# EAGLE design Mega8515_flasher_v2 (EAGLE 8.1.0)
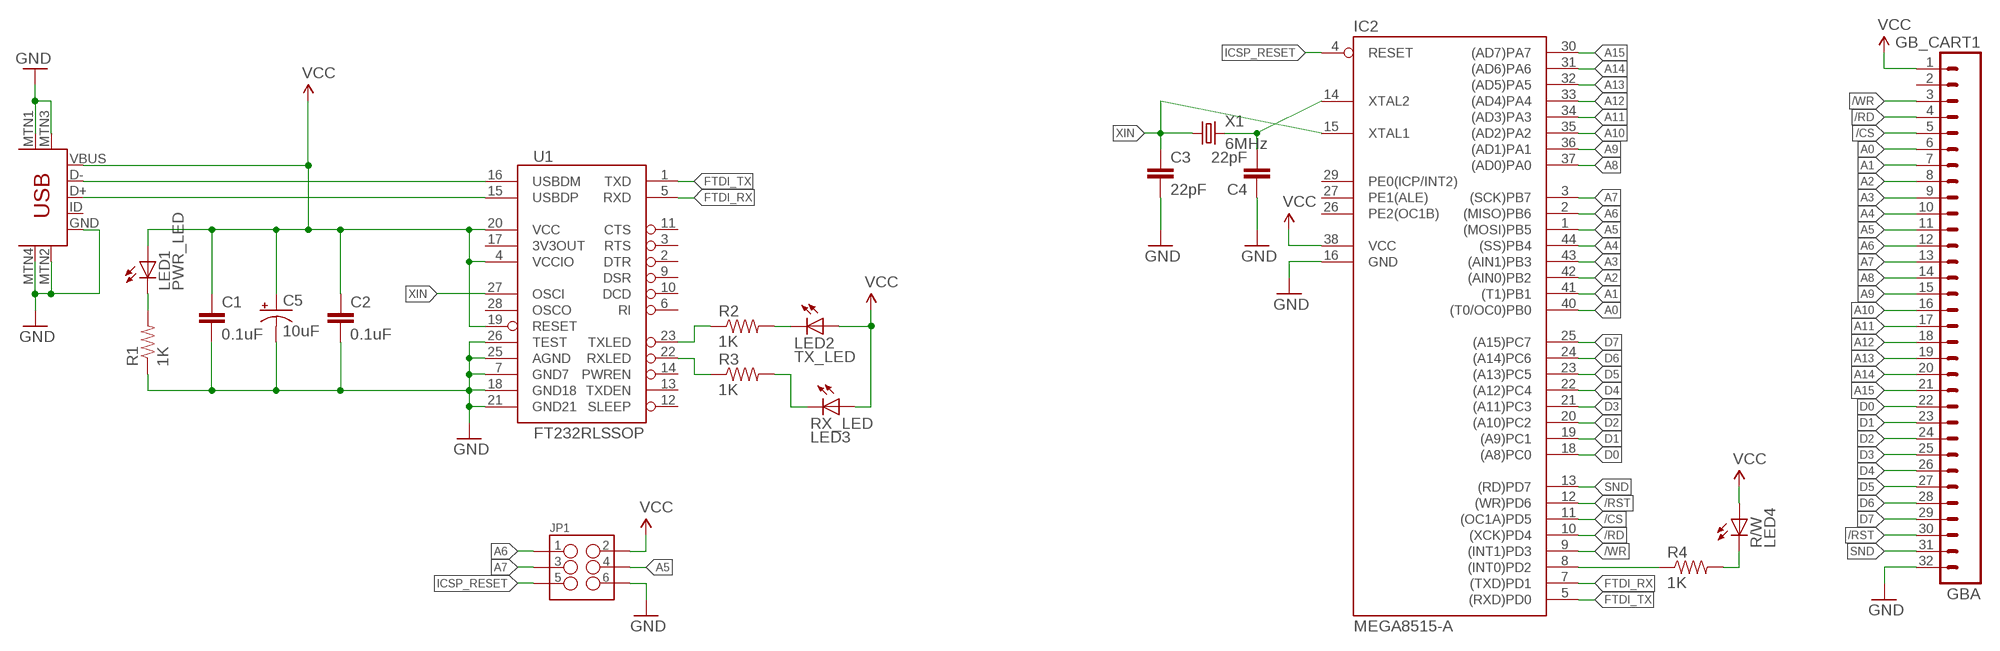
[diagram p0: schematic, sheet 1]

## Parts
C1  0.1uF  CAP1206  [1206]
C2  0.1uF  CAP1206  [1206]
C3  22pF  CAP0805  [0805]
C4  22pF  CAP0805  [0805]
C5  10uF  10UF-TANT  [EIA3216]
GBA  GB_CART1  [GB_CART_1]
IC2  MEGA8515-A  [TQFP44]
JP1  SPARKFUN-CONNECTORS_M03X2SMT  [SPARKFUN-CONNECTORS_2X3_SMT_POSTS]
LED1  PWR_LED  LED1206  [LED-1206]
LED2  TX_LED  LED1206  [LED-1206]
R1  1K  RESISTOR1206  [1206]
R2  1K  RESISTOR1206  [1206]
R3  1K  RESISTOR1206  [1206]
R4  1K  RESISTOR1206  [1206]
R/W  LED4  LED1206  [LED-1206]
RX_LED  LED3  LED1206  [LED-1206]
U1  FT232RLSSOP  [SSOP28DB]
USB  USB-MINIB-5PIN  [USB-MINIB]
X1  6MHz  SPARKFUN-FREQCTRL_CRYSTAL  [SPARKFUN-FREQCTRL_CRYSTAL-SMD-11.8X5.5]

## Nets
/CS: GBA.5 IC2.11((OC1A)PD5)
/RD: GBA.4 IC2.10((XCK)PD4)
/RST: GBA.30 IC2.12((WR)PD6)
/WR: GBA.3 IC2.9((INT1)PD3)
A0: GBA.6 IC2.40((T0/OC0)PB0)
A1: GBA.7 IC2.41((T1)PB1)
A2: GBA.8 IC2.42((AIN0)PB2)
A3: GBA.9 IC2.43((AIN1)PB3)
A4: GBA.10 IC2.44((SS)PB4)
A5: GBA.11 IC2.1((MOSI)PB5) JP1.4
A6: GBA.12 IC2.2((MISO)PB6) JP1.1
A7: GBA.13 IC2.3((SCK)PB7) JP1.3
A8: GBA.14 IC2.37((AD0)PA0)
A9: GBA.15 IC2.36((AD1)PA1)
A10: GBA.16 IC2.35((AD2)PA2)
A11: GBA.17 IC2.34((AD3)PA3)
A12: GBA.18 IC2.33((AD4)PA4)
A13: GBA.19 IC2.32((AD5)PA5)
A14: GBA.20 IC2.31((AD6)PA6)
A15: GBA.21 IC2.30((AD7)PA7)
D0: GBA.22 IC2.18((A8)PC0)
D1: GBA.23 IC2.19((A9)PC1)
D2: GBA.24 IC2.20((A10)PC2)
D3: GBA.25 IC2.21((A11)PC3)
D4: GBA.26 IC2.22((A12)PC4)
D5: GBA.27 IC2.23((A13)PC5)
D6: GBA.28 IC2.24((A14)PC6)
D7: GBA.29 IC2.25((A15)PC7)
FTDI_RX: IC2.7((TXD)PD1) U1.5(RXD)
FTDI_TX: IC2.5((RXD)PD0) U1.1(TXD)
GND: C1.2 C2.2 C3.2 C4.1 C5.C(-) GBA.32 IC2.16(GND) JP1.6 R1.1 U1.7(GND7) U1.18(GND18) U1.21(GND21) U1.25(AGND) U1.26(TEST) USB.GND USB.MTN1(MTN2) USB.MTN2(MTN3) USB.MTN3(MTN1) USB.MTN4
ICSP_RESET: IC2.4(RESET) JP1.5
N$1: C4.2 IC2.14(XTAL2) X1.2 X1.3
N$5: R4.2 R/W.C
N$8: R3.2 RX_LED.C
N$9: LED2.C R2.2
N$13: U1.16(USBDM) USB.D-
N$14: U1.15(USBDP) USB.D+
N$16: LED1.C R1.2
RWLED: IC2.8((INT0)PD2) R4.1
RXLED: R3.1 U1.22(RXLED)
SND: GBA.31 IC2.13((RD)PD7)
TXLED: R2.1 U1.23(TXLED)
VCC: C1.1 C2.1 C5.A(+) GBA.1 IC2.38(VCC) JP1.2 LED1.A LED2.A R/W.A RX_LED.A U1.4(VCCIO) U1.19(RESET) U1.20(VCC) USB.VBUS
XIN: C3.1 IC2.15(XTAL1) U1.27(OSCI) X1.1 X1.4
Unconnected: GBA.2 IC2.6(NC1) IC2.17(NC2) IC2.26(PE2(OC1B)) IC2.27(PE1(ALE)) IC2.28(NC3) IC2.29(PE0(ICP/INT2)) IC2.39(NC4) U1.2(DTR) U1.3(RTS) U1.6(RI) U1.9(DSR) U1.10(DCD) U1.11(CTS) U1.12(SLEEP) U1.13(TXDEN) U1.14(PWREN) U1.17(3V3OUT) U1.28(OSCO) USB.ID

## Library data of the parts
C1-C4 = SparkFun-Capacitors:CAP: Capacitor Standard 0603 ceramic capacitor, and 0.1" leaded capacitor.
C5 = SparkFun-Capacitors:10UF-TANT: 10uF Tantalum SMT CAP-00811- 16V 10% (EIA-3216); PROD_ID: CAP-00811
GBA = alex:GB_CART
IC2 = atmel:MEGA8515: MICROCONTROLLER 8 Kbytes FLASH 512 bytes SRAM 512 bytes EEPROM USART 8-channel 10 bit ADC Source: avr.lbr; MPN: ATMEGA8515-16AU; OC_FARNELL: 9171410; OC_NEWARK: 01M6904
JP1 = Mega8515_flasher:SPARKFUN-CONNECTORS_M03X2: 2x3 .1" header. Shrouded, with keying- CONN-10681 SMT- CONN-11415 Pogo pins- HW-11044; PROD_ID: CONN-11415
LED1 LED2 R/W RX_LED = SparkFun-LED:LED: LEDs Standard schematic elements and footprints for 5mm, 3mm, 1206, and 0603 sized LEDs. 5mm - Spark Fun Electronics SKU : COM-00529 (and others)
R1-R4 = SparkFun-Resistors:RESISTOR: Resistor Basic schematic elements and footprints for 0603, 1206, and PTH resistors.
U1 = SparkFun-DigitalIC:FT232RL: USB UART FT232RL 4th Generation USB UART (USB <-> Serial) Controller. Spark Fun Electronics SKU : COM-00650 Production SKU IC-00870; PROD_ID: IC-00870
USB = SparkFun-Connectors:USB-MINIB: Mini-USB "B" connector with 5th pin broken out. Created new symbol breaking out 5th "ID" pin in mini/micro USB connector spec. See: http://en.wikipedia.org/wiki/Mini_usb#Cables. Uses same footprint as 4-pin symbol. Also added pins to connect to mounting / shield pads if required (probably not generally needed as signals aren't shielded once they leave the connector).
X1 = Mega8515_flasher:SPARKFUN-FREQCTRL_CRYSTAL: Various standard crystals. Proven footprints. Spark Fun Electronics SKU : COM-00534

## Net classes
0 default: width 0.152 mm, drill 0.305 mm, clearance 0.152 mm

## Board
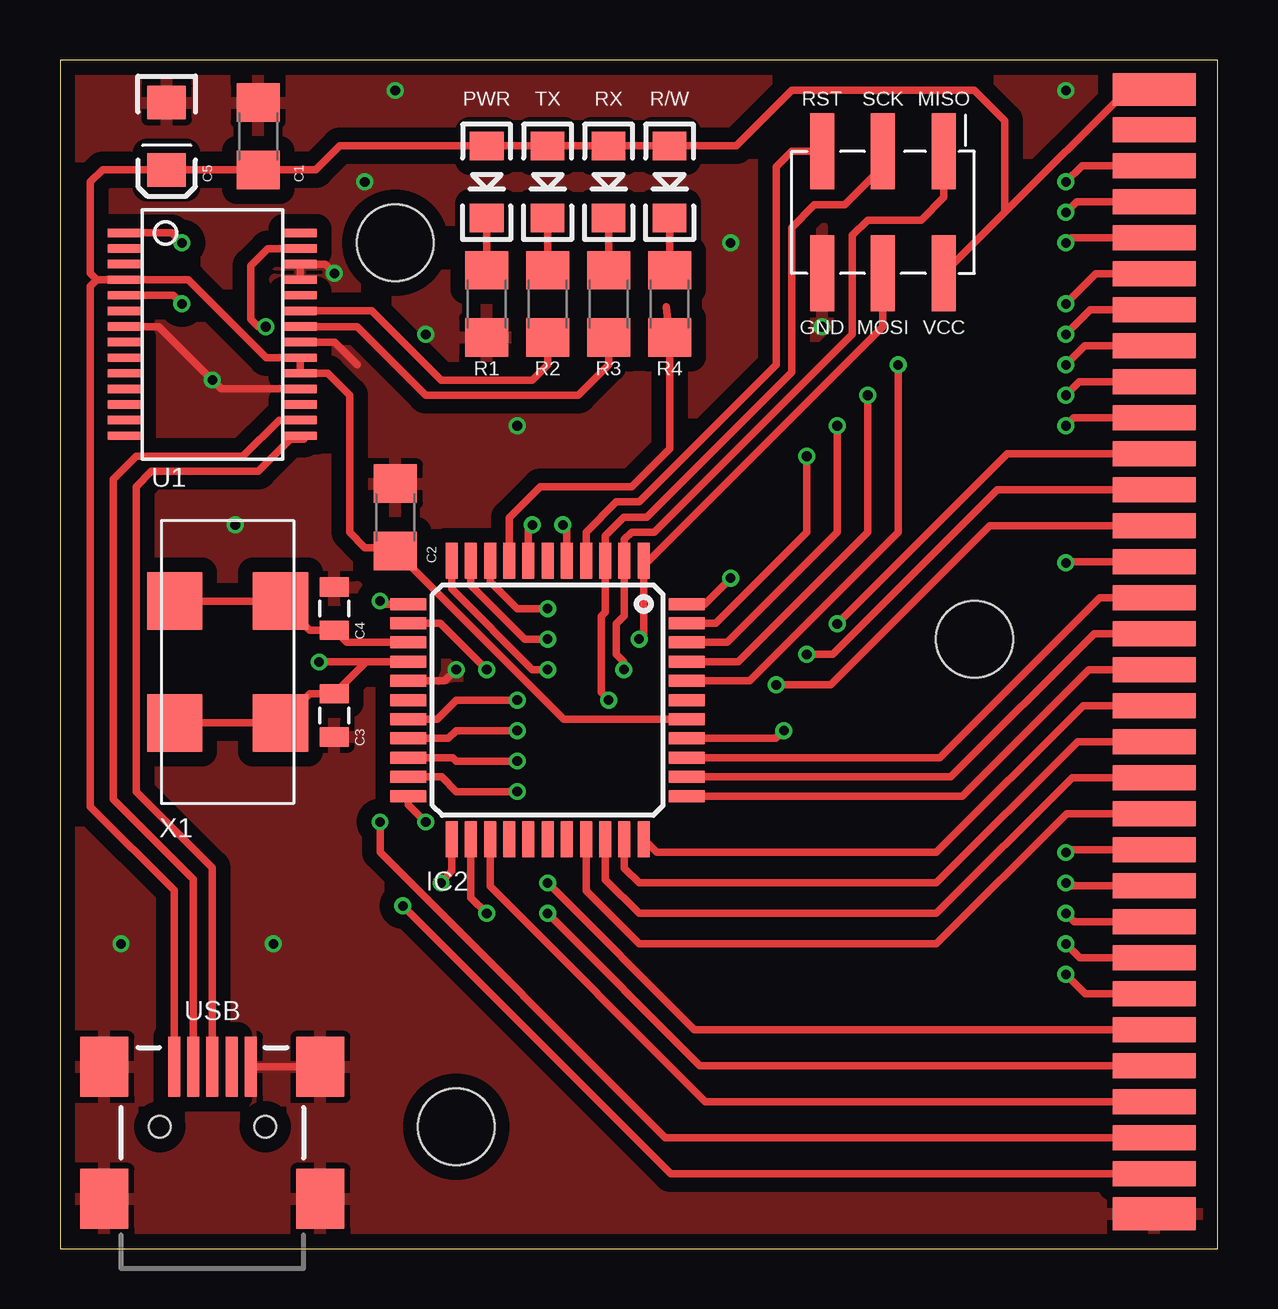
[diagram p1: board, top side]
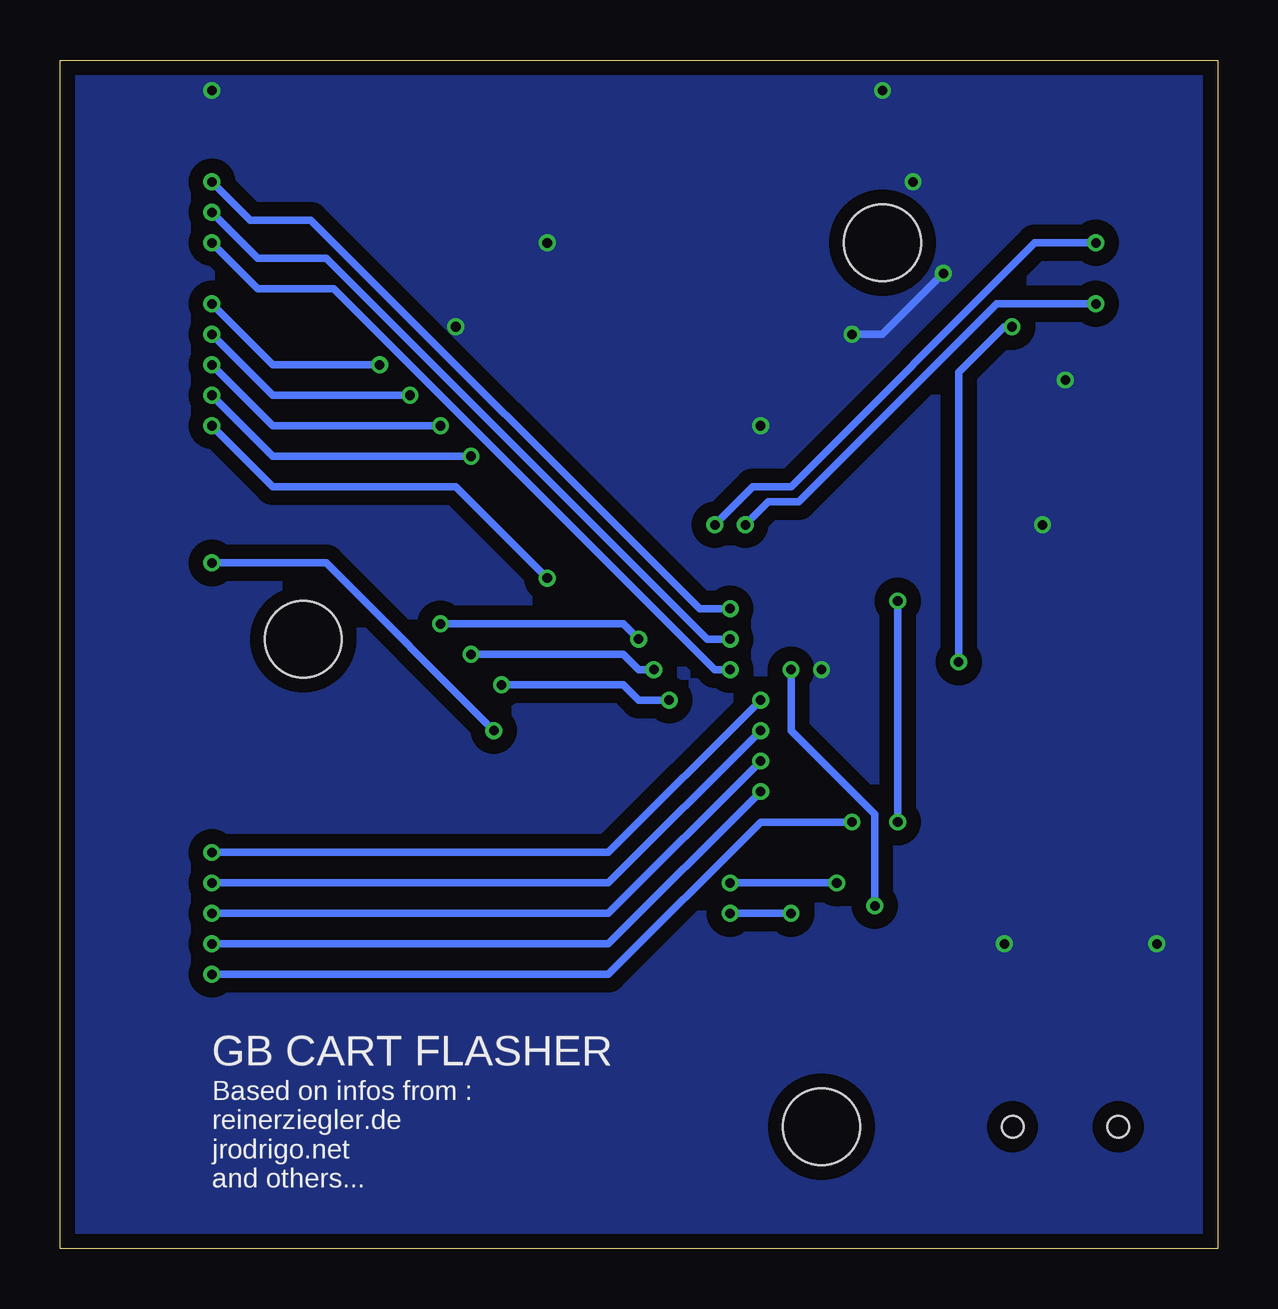
[diagram p2: board, bottom side, seen from below]

Size 48.24 x 49.53 mm. Coordinates in mm from the lower left corner, seen from the top.
Outline: 0,0 48.24,0 48.24,49.53 0,49.53 0,0
Copper layers (1*16): Top 0.035mm / dielectric 1.6mm / Bottom 0.035mm
Design rules "Elecrow_2-layer_PCB_eagle_rule *": minimum track width 6mil, minimum drill 12mil, track to track 6mil, track to pad 6mil, pad to pad 6mil, via to via 8mil, smd to smd 0mil, copper to edge 20mil, drill to drill 10mil, minimum pad ring 6mil, minimum via ring 6mil, stop-mask expansion 0mil, vias tented up to drill 100mil, thermal gap 10mil
Holes 3.2 mm at 38.1,25.4 16.51,5.08 13.97,41.91

### Footprints (pad centres in the part's own frame; a part is rotated, then mirrored left to right if it is on the bottom)
1206 = smd 1.6 x 1.8: 1 -1.4,0; 2 1.4,0
0805 = smd 0.8 x 1.2: 1 -0.9,0; 2 0.9,0
EIA3216 = smd 1.4 x 1.6: A 1.4,0; C -1.4,0
GB_CART_1 = smd 1.36 x 3.46: 1 -22.895,-0.12; 32 23.94,-0.12 | smd 1.03 x 3.46: 2 -21.225,-0.12; 3 -19.725,-0.12; 4 -18.225,-0.12; 5 -16.725,-0.12; 6 -15.225,-0.12; 7 -13.725,-0.12; 8 -12.225,-0.12; 9 -10.725,-0.12; 10 -9.225,-0.12; 11 -7.725,-0.12; 12 -6.225,-0.12; 13 -4.725,-0.12; 14 -3.225,-0.12; 15 -1.725,-0.12; 16 -0.225,-0.12; 17 1.275,-0.12; 18 2.775,-0.12; 19 4.275,-0.12; 20 5.775,-0.12; 21 7.275,-0.12; 22 8.775,-0.12; 23 10.275,-0.12; 24 11.775,-0.12; 25 13.275,-0.12; 26 14.775,-0.12; 27 16.275,-0.12; 28 17.775,-0.12; 29 19.275,-0.12; 30 20.775,-0.12; 31 22.275,-0.12
TQFP44 = smd 1.5 x 0.5: 1 -5.8,4; 2 -5.8,3.2; 3 -5.8,2.4; 4 -5.8,1.6; 5 -5.8,0.8; 6 -5.8,0; 7 -5.8,-0.8; 8 -5.8,-1.6; 9 -5.8,-2.4; 10 -5.8,-3.2; 11 -5.8,-4; 23 5.8,-4; 24 5.8,-3.2; 25 5.8,-2.4; 26 5.8,-1.6; 27 5.8,-0.8; 28 5.8,0; 29 5.8,0.8; 30 5.8,1.6; 31 5.8,2.4; 32 5.8,3.2; 33 5.8,4 | smd 0.5 x 1.5: 12 -4,-5.8; 13 -3.2,-5.8; 14 -2.4,-5.8; 15 -1.6,-5.8; 16 -0.8,-5.8; 17 0,-5.8; 18 0.8,-5.8; 19 1.6,-5.8; 20 2.4,-5.8; 21 3.2,-5.8; 22 4,-5.8; 34 4,5.8; 35 3.2,5.8; 36 2.4,5.8; 37 1.6,5.8; 38 0.8,5.8; 39 0,5.8; 40 -0.8,5.8; 41 -1.6,5.8; 42 -2.4,5.8; 43 -3.2,5.8; 44 -4,5.8
SPARKFUN-CONNECTORS_2X3_SMT_POSTS = smd 1 x 3.17: 1 -2.54,-2.54; 2 -2.54,2.54; 3 0,-2.54; 4 0,2.54; 5 2.54,-2.54; 6 2.54,2.54
LED-1206 = smd 1.2 x 1.4: A -1.5,0; C 1.5,0
SSOP28DB = smd 0.348 x 1.397: 1 -4.225,-3.656; 2 -3.575,-3.656; 3 -2.925,-3.656; 4 -2.275,-3.656; 5 -1.625,-3.656; 6 -0.975,-3.656; 7 -0.325,-3.656; 8 0.325,-3.656; 9 0.975,-3.656; 10 1.625,-3.656; 11 2.275,-3.656; 12 2.925,-3.656; 13 3.575,-3.656; 14 4.225,-3.656; 15 4.225,3.656; 16 3.575,3.656; 17 2.925,3.656; 18 2.275,3.656; 19 1.625,3.656; 20 0.975,3.656; 21 0.325,3.656; 22 -0.325,3.656; 23 -0.975,3.656; 24 -1.625,3.656; 25 -2.275,3.656; 26 -2.925,3.656; 27 -3.575,3.656; 28 -4.225,3.656
USB-MINIB = smd 2.5 x 0.5: D+ 2.5,0; D- 2.5,0.8; GND 2.5,-1.6; ID 2.5,-0.8; VBUS 2.5,1.6 | smd 2.5 x 2: MTN1 -3,4.5; MTN2 2.5,4.5; MTN3 -3,-4.5; MTN4 2.5,-4.5 | hole 0.9: 0,2.2; 0,-2.2
SPARKFUN-FREQCTRL_CRYSTAL-SMD-11.8X5.5 = smd 2.4 x 2.3: 1 -2.54,-2.2; 2 2.54,-2.2; 3 2.54,2.2; 4 -2.54,2.2

### Placement (x,y rotation side)
C1  8.26,46.35 90 top
C2  13.97,30.48 90 top
C3  11.43,22.23 270 top
C4  11.43,26.67 270 top
C5  4.45,46.35 270 top
GBA  45.72,25.4 270 top
IC2  20.32,22.86 270 top
JP1  34.29,43.18 180 top
LED1  17.78,44.45 270 top
LED2  20.32,44.45 270 top
R1  17.78,39.37 90 top
R2  20.32,39.37 90 top
R3  22.86,39.37 90 top
R4  25.4,39.37 90 top
R/W  25.4,44.45 270 top
RX_LED  22.86,44.45 270 top
U1  6.35,38.1 270 top
USB  6.35,5.08 90 top
X1  6.99,24.45 90 top

### Tracks (layer width: path | path; a pad name or v marks a point on that pad's centre or on a via)
/CS  (via drill 0.4)
  Top 0.305: IC2.11 16.32,27.5 19.68,24.13 v20.32,24.13 | GBA.5 42.12,42.12 v41.91,41.91
  Bottom 0.305: v20.32,24.13 20.95,24.13 36.83,40.01 40.01,40.01 v41.91,41.91
/RD  (via drill 0.4)
  Top 0.305: IC2.10 17.12,27.65 19.37,25.4 v20.32,25.4 | GBA.4 42.35,43.62 v41.91,43.18
  Bottom 0.305: v20.32,25.4 21.27,25.4 37.15,41.27 40.01,41.27 v41.91,43.18
/RST  (via drill 0.4)
  Top 0.305: 13.78,26.86 IC2.12 13.46,26.86 v13.34,26.99 | GBA.30 25.22,4.62 13.34,16.51 v13.34,17.78
  Bottom 0.305: v13.34,17.78 v13.34,26.99
/WR  (via drill 0.4)
  Top 0.305: IC2.9 17.92,27.8 19.05,26.67 v20.32,26.67 | GBA.3 42.59,45.12 v41.91,44.45
  Bottom 0.305: v20.32,26.67 21.59,26.67 37.78,42.86 40.32,42.86 v41.91,44.45
A0  (via drill 0.4)
  Top 0.305: IC2.40 28.74,23.66 34.92,29.84 v34.92,36.83 | GBA.6 43.16,40.62 v41.91,39.37
  Bottom 0.305: v34.92,36.83 39.37,36.83 v41.91,39.37
A1  (via drill 0.4)
  Top 0.305: 27.61,24.46 IC2.41 28.27,24.46 33.66,29.84 v33.66,35.56 | GBA.7 42.94,39.12 v41.91,38.1
  Bottom 0.305: v33.66,35.56 39.37,35.56 v41.91,38.1
A2  (via drill 0.4)
  Top 0.305: IC2.42 27.8,25.26 32.38,29.84 v32.38,34.29 | GBA.8 42.7,37.62 v41.91,36.83
  Bottom 0.305: v32.38,34.29 39.37,34.29 v41.91,36.83
A3  (via drill 0.4)
  Top 0.305: IC2.43 27.33,26.06 31.11,29.84 v31.11,33.02 | GBA.9 42.48,36.12 v41.91,35.56
  Bottom 0.305: v31.11,33.02 39.37,33.02 v41.91,35.56
A4  (via drill 0.4)
  Top 0.305: IC2.44 26.86,26.86 v27.94,27.94 | GBA.10 42.24,34.62 v41.91,34.29
  Bottom 0.305: v27.94,27.94 31.75,31.75 39.37,31.75 v41.91,34.29
A5  (via drill 0.4)
  Top 0.305: JP1.4 34.29,38.42 24.53,28.66 IC2.1 24.32,25.59 v24.13,25.4 | GBA.11 39.48,33.12 v32.38,26.04
  Bottom 0.305: v32.38,26.04 24.77,26.04 v24.13,25.4
A6  (via drill 0.4)
  Top 0.305: IC2.2 23.52,29.55 23.81,29.84 24.77,29.84 33.02,38.1 33.02,42.23 33.66,42.86 35.88,42.86 36.83,43.81 JP1.1 | GBA.12 39.05,31.62 32.19,24.77 v31.11,24.77 | 23.5,28.64 IC2.2 | v23.5,24.13 23.5,24.45 23.18,24.77 23.18,26.04 23.52,26.38 IC2.2
  Bottom 0.305: v23.5,24.13 24.13,24.13 24.77,24.77 v31.11,24.77
A7  (via drill 0.4)
  Top 0.305: 34.29,44.45 34.29,45.09 | JP1.3 34.29,45.09 | 34.29,45.09 32.7,43.5 31.43,43.5 30.48,42.55 30.48,36.51 24.45,30.48 23.5,30.48 22.72,29.7 IC2.3 22.72,26.53 22.54,26.35 22.54,23.18 v22.86,22.86 22.72,23 | GBA.13 38.73,30.12 32.1,23.5 v29.84,23.5
  Bottom 0.305: v22.86,22.86 24.13,22.86 24.77,23.5 v29.84,23.5
A8  (via drill 0.4)
  Top 0.305: GBA.14 41.96,28.62 v41.91,28.57 | v30.16,21.59 29.83,21.26 IC2.37
  Bottom 0.305: v41.91,28.57 37.15,28.57 v30.16,21.59
A9
  Top 0.305: GBA.15 43.32,27.12 36.65,20.46 IC2.36
A10
  Top 0.305: GBA.16 43.09,25.62 37.12,19.66 IC2.35
A11
  Top 0.305: GBA.17 42.86,24.12 37.59,18.86 IC2.34
A12
  Top 0.305: GBA.18 42.63,22.62 36.51,16.51 24.87,16.51 IC2.33
A13
  Top 0.305: GBA.19 42.4,21.12 36.51,15.24 24.13,15.24 23.52,15.85 IC2.32
A14
  Top 0.305: GBA.20 42.17,19.62 36.51,13.97 24.13,13.97 22.72,15.38 IC2.31
A15
  Top 0.305: GBA.21 41.94,18.12 36.51,12.7 24.13,12.7 21.92,14.91 IC2.30
D0  (via drill 0.4)
  Top 0.305: IC2.18 15.71,22.06 16.51,22.86 v19.05,22.86 | GBA.22 42.02,16.62 v41.91,16.51
  Bottom 0.305: v41.91,16.51 25.4,16.51 v19.05,22.86
D1  (via drill 0.4)
  Top 0.305: IC2.19 16.18,21.26 16.51,21.59 v19.05,21.59 | GBA.23 42.02,15.12 v41.91,15.24
  Bottom 0.305: v41.91,15.24 25.4,15.24 v19.05,21.59
D2  (via drill 0.4)
  Top 0.305: IC2.20 16.37,20.46 16.51,20.32 v19.05,20.32 | GBA.24 42.26,13.62 v41.91,13.97
  Bottom 0.305: v41.91,13.97 25.4,13.97 v19.05,20.32
D3  (via drill 0.4)
  Top 0.305: IC2.21 15.9,19.66 16.51,19.05 v19.05,19.05 | GBA.25 42.48,12.12 v41.91,12.7
  Bottom 0.305: v41.91,12.7 25.4,12.7 v19.05,19.05
D4  (via drill 0.4)
  Top 0.305: GBA.26 42.72,10.62 v41.91,11.43 | IC2.22 14.52,18.5 v15.24,17.78
  Bottom 0.305: v41.91,11.43 25.4,11.43 19.05,17.78 v15.24,17.78
D5  (via drill 0.4)
  Top 0.305: GBA.27 26.43,9.12 v20.32,15.24 | IC2.23 16.32,15.75 v15.88,15.24
  Bottom 0.305: v15.88,15.24 v20.32,15.24
D6  (via drill 0.4)
  Top 0.305: IC2.24 17.12,14.63 v17.78,13.97 | GBA.28 26.66,7.62 v20.32,13.97
  Bottom 0.305: v17.78,13.97 v20.32,13.97
D7
  Top 0.305: IC2.25 17.92,15.1 26.89,6.12 GBA.29
FTDI_RX  (via drill 0.4)
  Top 0.305: IC2.7 19.52,30.01 v19.68,30.16 | U1.5 4.72,39.73 v5.08,39.37
  Bottom 0.305: v19.68,30.16 18.73,31.11 17.46,31.11 9.21,39.37 v5.08,39.37
FTDI_TX  (via drill 0.4)
  Top 0.305: U1.1 4.67,42.33 v5.08,41.91 | IC2.5 21.12,30 v20.95,30.16
  Bottom 0.305: v20.95,30.16 19.37,31.75 17.78,31.75 7.62,41.91 v5.08,41.91
GND  (via drill 0.4)
  Top 0.305: IC2.16 16.04,23.66 v16.51,24.13 | USB.GND USB.MTN4 | U1.7 4.12,38.42 v6.35,36.2 6.72,35.83 U1.18 | U1.21 11.44,37.77 12.38,36.83 | U1.25 U1.26 11.04,41.02 v11.43,40.64
  Bottom 0.305: v11.43,40.64 13.97,38.1 v15.24,38.1
  other vias: 19.05,34.29 12.7,44.45 31.75,38.42 8.89,12.7 7.3,30.16 27.94,41.91 41.91,48.26 2.54,12.7 13.97,48.26
  pour Top (isolate 0.61): 0,49.53 48.26,49.53 48.26,0 0,0
  pour Bottom (isolate 0.61): 48.26,49.53 0,49.53 0,0 48.26,0
ICSP_RESET
  Top 0.305: JP1.5 30.48,45.72 29.84,45.09 29.84,36.83 24.13,31.11 23.18,31.11 21.92,29.86 IC2.4
N$1
  Top 0.305: IC2.14 11.94,25.26 C4.2 10.4,25.77 X1.2 X1.3
N$5
  Top 0.305: R4.2 R/W.C
N$8
  Top 0.305: R3.2 RX_LED.C
N$9
  Top 0.305: LED2.C R2.2
N$13
  Top 0.305: U1.16 9.12,34.52 7.62,33.02 3.17,33.02 2.22,32.07 2.22,18.73 5.55,15.4 USB.D-
N$14
  Top 0.305: U1.15 10.16,33.72 9.59,33.72 8.26,32.38 3.81,32.38 3.17,31.75 3.17,19.05 6.35,15.88 USB.D+
N$16
  Top 0.305: LED1.C R1.2
RWLED
  Top 0.305: 25.27,39.24 R4.1 25.4,33.34 23.81,31.75 20,31.75 18.72,30.47 IC2.8
RXLED
  Top 0.305: R3.1 22.86,36.83 21.59,35.56 15.24,35.56 12.38,38.42 U1.22
SND  (via drill 0.4)
  Top 0.305: GBA.31 25.45,3.12 v14.29,14.29 | IC2.13 15.85,26.06 v17.78,24.13
  Bottom 0.305: v17.78,24.13 17.78,21.59 14.29,18.1 v14.29,14.29
TXLED
  Top 0.305: R2.1 20.32,36.83 19.68,36.2 15.88,36.2 12.99,39.08 U1.23
VCC
  Top 0.305: 39.37,43.18 39.37,46.99 38.1,48.26 30.48,48.26 28.17,45.95 R/W.A RX_LED.A LED2.A LED1.A 11.66,45.95 10.66,44.95 C1.1 C5.A 1.77,44.95 1.27,44.45 1.27,40.64 1.53,40.38 | 39.37,43.18 JP1.2 | GBA.1 44.48,48.3 39.37,43.18 | IC2.38 20.99,22.06 C2.1 13.84,29.21 12.7,29.21 12.06,29.84 12.06,35.56 11.15,36.48 U1.19 U1.20 8.6,37.12 5.34,40.38 U1.4 1.53,40.38 | 1.53,40.38 1.27,40.11 1.27,18.41 4.75,14.94 USB.VBUS
XIN  (via drill 0.4)
  Top 0.305: U1.27 8.65,41.67 7.94,40.96 7.94,38.73 8.26,38.42 v8.57,38.42 | IC2.15 12.77,24.46 | 12.77,24.46 C3.1 10.4,23.12 X1.1 X1.4 | 12.77,24.46 10.81,24.46 v10.79,24.45
  Bottom 0.305: v8.57,38.42 8.89,38.42 10.79,36.51 v10.79,24.45

### Text on the board
bPlace: GB CART FLASHER | Based on infos from : / reinerziegler.de / jrodrigo.net / and others...
tNames: PWR | TX | RX | R/W | RST | SCK | MISO | GND | MOSI | VCC